# EAGLE design Krobot_UI (EAGLE 6.5.0)
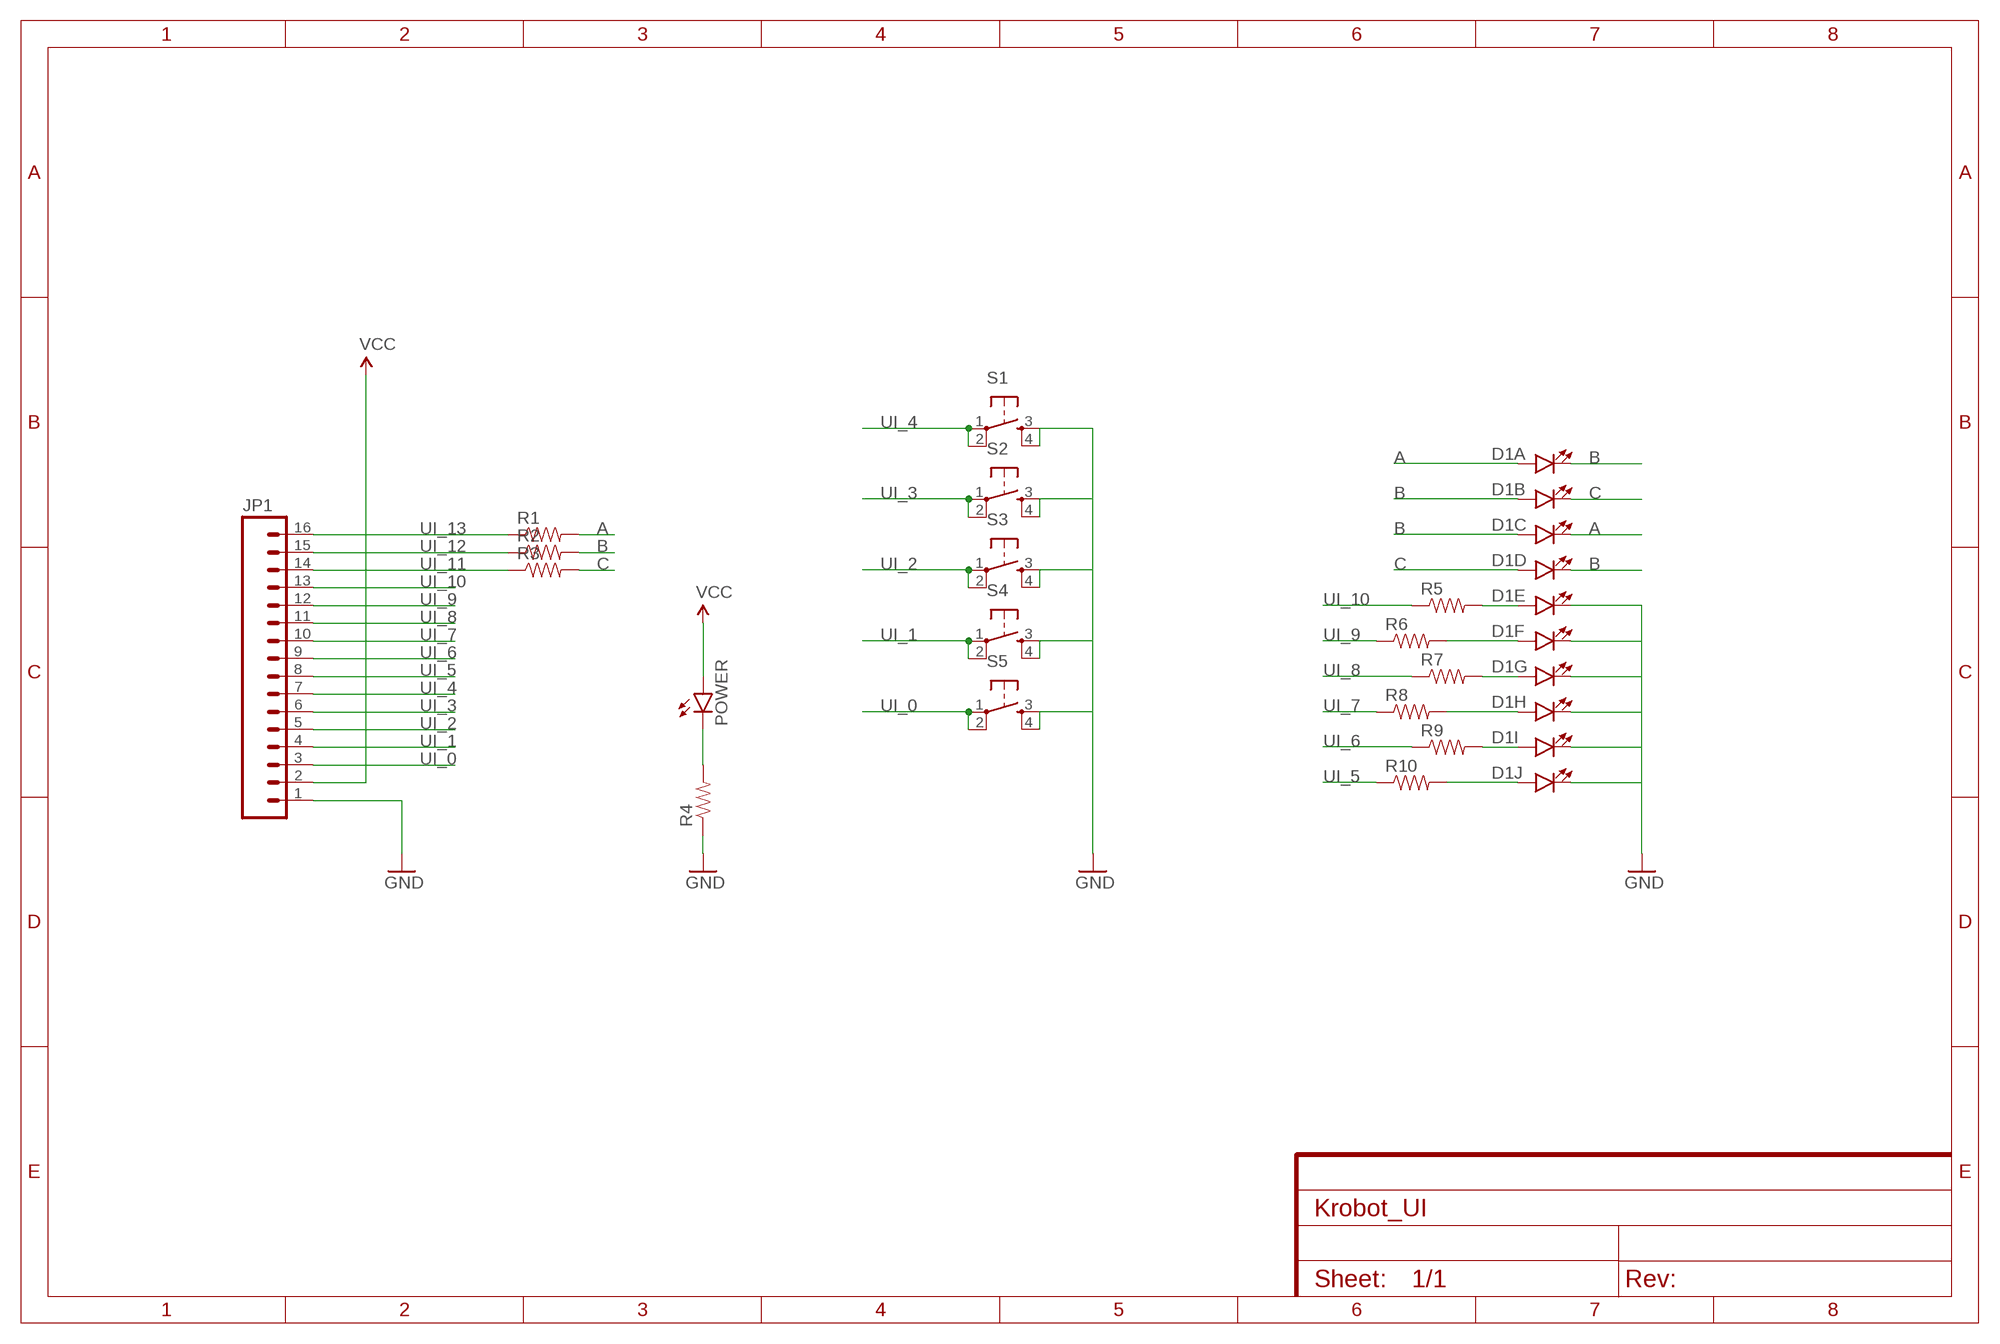
[diagram p0: schematic, sheet 1]

## Parts
D1  LED_BARGRAPH_10  [LED_BARGAPH_10]
JP1  M16LONGPADS  [1X16_LONGPADS]
POWER  LED1206  [LED-1206]
R1  RESISTOR1206  [1206]
R2  RESISTOR1206  [1206]
R3  RESISTOR1206  [1206]
R4  RESISTOR1206  [1206]
R5  RESISTOR1206  [1206]
R6  RESISTOR1206  [1206]
R7  RESISTOR1206  [1206]
R8  RESISTOR1206  [1206]
R9  RESISTOR1206  [1206]
R10  RESISTOR1206  [1206]
S1  TAC_SWITCHPTH  [TACTILE-PTH]
S2  TAC_SWITCHPTH  [TACTILE-PTH]
S3  TAC_SWITCHPTH  [TACTILE-PTH]
S4  TAC_SWITCHPTH  [TACTILE-PTH]
S5  TAC_SWITCHPTH  [TACTILE-PTH]

## Nets
A: D1.1(A:A) D1.18(C:C) R1.2
B: D1.2(B:A) D1.3(C:A) D1.17(D:C) D1.20(A:C) R2.2
C: D1.4(D:A) D1.19(B:C) R3.2
GND: D1.11(J:C) D1.12(I:C) D1.13(H:C) D1.14(G:C) D1.15(F:C) D1.16(E:C) JP1.1 R4.1 S1.3 S1.4 S2.3 S2.4 S3.3 S3.4 S4.3 S4.4 S5.3 S5.4
N$1: D1.5(E:A) R5.2
N$2: D1.6(F:A) R6.2
N$3: D1.7(G:A) R7.2
N$4: D1.8(H:A) R8.2
N$5: D1.9(I:A) R9.2
N$6: D1.10(J:A) R10.2
N$13: POWER.C R4.2
UI_0: JP1.3 S5.1 S5.2
UI_1: JP1.4 S4.1 S4.2
UI_2: JP1.5 S3.1 S3.2
UI_3: JP1.6 S2.1 S2.2
UI_4: JP1.7 S1.1 S1.2
UI_5: JP1.8 R10.1
UI_6: JP1.9 R9.1
UI_7: JP1.10 R8.1
UI_8: JP1.11 R7.1
UI_9: JP1.12 R6.1
UI_10: JP1.13 R5.1
UI_11: JP1.14 R3.1
UI_12: JP1.15 R2.1
UI_13: JP1.16 R1.1
VCC: JP1.2 POWER.A

## Library data of the parts
D1 = SparkFun-LED:LED_BARGRAPH_10: 10-Segment LED Bar Graph SFE part numbers: COM-09935 (red, Vf = 2.1V, Ifmax = 20mA) COM-09936 (yellow, Vf = 2.1V, Ifmax = 20mA) COM-09937 (blue, Vf = 3.4V, Ifmax = 20mA) COM-09938 (green, Vf = 3.4V, Ifmax = 20mA)
JP1 = SparkFun-Connectors:M16: 1x16 .1" header
POWER = SparkFun-LED:LED: LEDs Standard schematic elements and footprints for 5mm, 3mm, 1206, and 0603 sized LEDs. 5mm - Spark Fun Electronics SKU : COM-00529 (and others)
R1-R10 = SparkFun-Resistors:RESISTOR: Resistor Basic schematic elements and footprints for 0603, 1206, and PTH resistors.
S1-S5 = SparkFun-Electromechanical:TAC_SWITCH: Momentary Switch Button commonly used for reset or general input. Spark Fun Electronics SKU : COM-00097 SMT- SWCH-08247

## Board
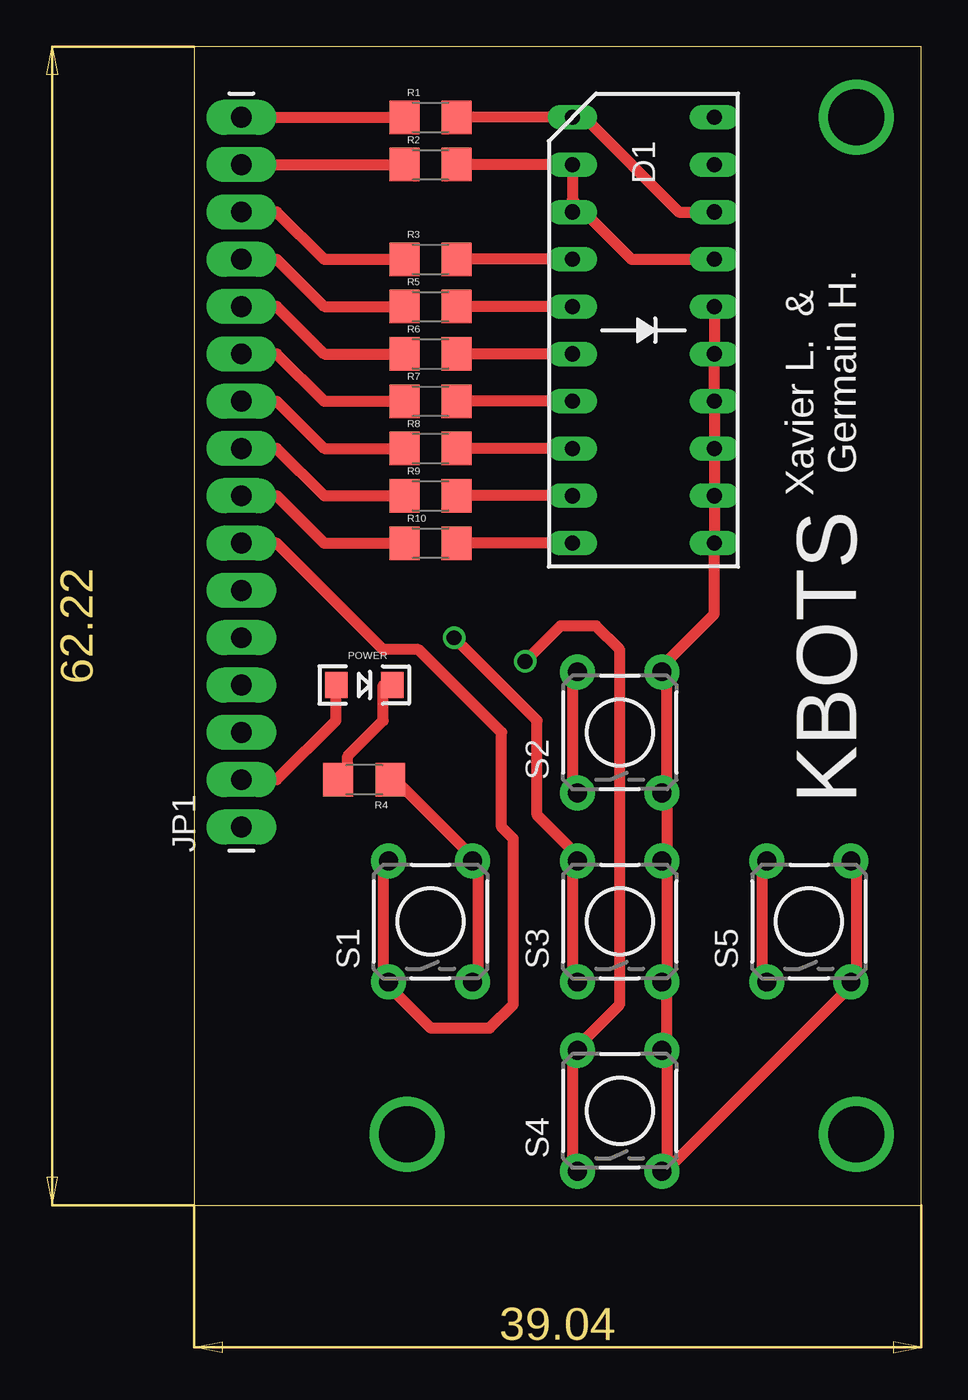
[diagram p1: board, top side]
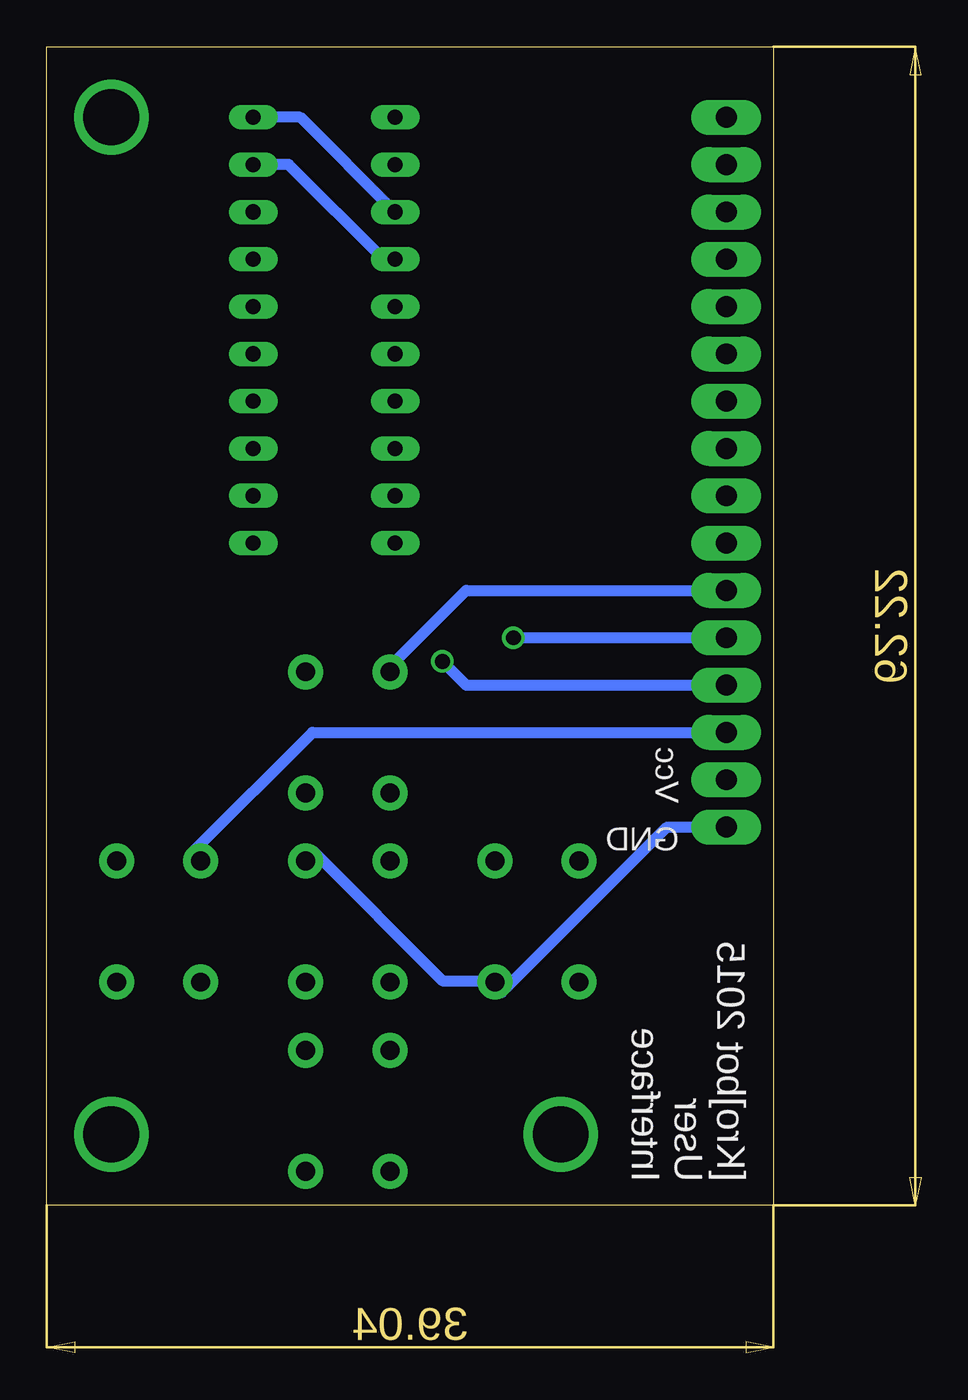
[diagram p2: board, bottom side, seen from below]

Size 39.04 x 62.22 mm. Coordinates in mm from the lower left corner, seen from the top.
Outline: 0,0 39.04,0 39.04,62.22 0,62.22 0,0
Copper layers (1*16): Top 0.035mm / dielectric 1.5mm / Bottom 0.035mm
Design rules "default *": minimum track width 0.6mm, minimum drill 0.8mm, track to track 0.8mm, track to pad 0.8mm, pad to pad 0.8mm, via to via 0.8mm, smd to smd 8mil, copper to edge 40mil, drill to drill 8mil, minimum pad ring 10mil, minimum via ring 8mil, stop-mask expansion 4mil, vias tented up to drill 0mil, thermal gap 10mil

### Footprints (pad centres in the part's own frame; a part is rotated, then mirrored left to right if it is on the bottom)
LED_BARGAPH_10 = drill 0.813 long: 1 -11.43,-3.81; 2 -8.89,-3.81; 3 -6.35,-3.81; 4 -3.81,-3.81; 5 -1.27,-3.81; 6 1.27,-3.81; 7 3.81,-3.81; 8 6.35,-3.81; 9 8.89,-3.81; 10 11.43,-3.81; 11 11.43,3.81; 12 8.89,3.81; 13 6.35,3.81; 14 3.81,3.81; 15 1.27,3.81; 16 -1.27,3.81; 17 -3.81,3.81; 18 -6.35,3.81; 19 -8.89,3.81; 20 -11.43,3.81
1X16_LONGPADS = drill 1.118 pad 1.88 long: 1 0,0; 2 2.54,0; 3 5.08,0; 4 7.62,0; 5 10.16,0; 6 12.7,0; 7 15.24,0; 8 17.78,0; 9 20.32,0; 10 22.86,0; 11 25.4,0; 12 27.94,0; 13 30.48,0; 14 33.02,0; 15 35.56,0; 16 38.1,0
LED-1206 = smd 1.2 x 1.4: A -1.5,0; C 1.5,0
1206 = smd 1.6 x 1.8: 1 -1.4,0; 2 1.4,0
TACTILE-PTH = drill 1.016 pad 1.88: 1 -3.251,2.261; 2 3.251,2.261; 3 -3.251,-2.261; 4 3.251,-2.261

### Placement (x,y rotation side)
D1  24.13,46.99 270 top
JP1  2.54,20.32 90 top
POWER  9.14,27.94 0 top
R1  12.7,58.42 0 top
R2  12.7,55.88 0 top
R3  12.7,50.8 0 top
R4  9.14,22.86 180 top
R5  12.7,48.26 0 top
R6  12.7,45.72 0 top
R7  12.7,43.18 0 top
R8  12.7,40.64 0 top
R9  12.7,38.1 0 top
R10  12.7,35.56 0 top
S1  12.7,15.24 90 top
S2  22.86,25.4 90 top
S3  22.86,15.24 90 top
S4  22.86,5.08 90 top
S5  33.02,15.24 90 top

### Tracks (layer width: path | path; a pad name or v marks a point on that pad's centre or on a via)
A
  Top 0.6: R1.2 D1.1 20.95,58.42 26.04,53.34 D1.18
B
  Top 0.6: R2.2 D1.2 20.32,53.98 | D1.17 23.5,50.8 20.32,53.98 | 20.32,53.98 D1.3
  Bottom 0.6: D1.20 25.4,58.42 D1.3
C
  Top 0.6: D1.4 R3.2
  Bottom 0.6: D1.19 26.04,55.88 20.95,50.8 D1.4
GND
  Top 0.6: S5.4 35.56,18.41 35.56,12.06 S5.3 34.92,11.43 25.4,1.91 | 25.4,1.91 25.4,8.26 S4.4 25.4,8.89 25.4,11.43 S3.3 25.4,12.06 25.4,18.41 S3.4 25.4,19.05 25.4,21.59 S2.3 25.4,22.23 25.4,28.57 S2.4 25.4,29.21 27.94,31.75 D1.11 D1.12 D1.13 D1.14 D1.15 D1.16 | 25.4,1.91 S4.3 | R4.1 10.79,22.86 14.61,19.05 S1.4 15.24,18.41 15.24,12.06 S1.3
  Bottom 0.6: JP1.1 5.71,20.32 14.61,11.43 S1.3 15.24,12.06 17.78,12.06 24.77,19.05 S3.4
N$1
  Top 0.6: D1.5 R5.2
N$2
  Top 0.6: D1.6 R6.2
N$3
  Top 0.6: D1.7 R7.2
N$4
  Top 0.6: D1.8 R8.2
N$5
  Top 0.6: D1.9 R9.2
N$6
  Top 0.6: D1.10 R10.2
N$7  (via drill 3 pad 3)
  other vias: 35.56,58.42 35.56,3.81 11.43,3.81
N$13
  Top 0.6: POWER.C 10.16,27.94 10.16,26.04 8.26,24.13 8.26,22.86 R4.2
UI_0
  Top 0.6: S5.1 30.48,12.06 30.48,18.41 S5.2
  Bottom 0.6: JP1.3 24.77,25.4 31.11,19.05 S5.2
UI_1  (via drill 0.8)
  Top 0.6: S4.1 20.32,1.91 20.32,8.26 S4.2 20.95,8.89 22.86,10.79 22.86,29.84 21.59,31.11 19.68,31.11 v17.78,29.21
  Bottom 0.6: JP1.4 16.51,27.94 v17.78,29.21
UI_2  (via drill 0.8)
  Top 0.6: S3.1 20.32,12.06 20.32,18.41 S3.2 20.32,19.05 18.41,20.95 18.41,26.04 v13.97,30.48
  Bottom 0.6: v13.97,30.48 JP1.5
UI_3
  Top 0.6: S2.1 20.32,22.23 20.32,28.57 S2.2
  Bottom 0.6: JP1.6 16.51,33.02 20.32,29.21 S2.2
UI_4
  Top 0.6: S1.2 10.16,18.41 10.16,12.06 S1.1 10.79,11.43 12.7,9.53 15.88,9.53 17.14,10.79 17.14,19.68 16.51,20.32 16.51,25.4 12.06,29.84 10.16,29.84 4.45,35.56 JP1.7
UI_5
  Top 0.6: R10.1 6.99,35.56 4.45,38.1 JP1.8
UI_6
  Top 0.6: R9.1 6.99,38.1 4.45,40.64 JP1.9
UI_7
  Top 0.6: R8.1 6.99,40.64 4.45,43.18 JP1.10
UI_8
  Top 0.6: R7.1 6.99,43.18 4.45,45.72 JP1.11
UI_9
  Top 0.6: R6.1 6.99,45.72 4.45,48.26 JP1.12
UI_10
  Top 0.6: R5.1 6.99,48.26 4.45,50.8 JP1.13
UI_11
  Top 0.6: R3.1 6.99,50.8 4.45,53.34 JP1.14
UI_12
  Top 0.6: JP1.15 R2.1
UI_13
  Top 0.6: JP1.16 R1.1
VCC
  Top 0.6: JP1.2 4.45,22.86 7.62,26.04 7.62,27.94 POWER.A

### Text on the board
tNames: Xavier L. & / Germain H. | KBOTS
bNames: Vcc | GND | [Kro]bot 2015 / User / Interface